# EAGLE schematic motorcontroller_doppeleinheit (EAGLE 7.7.0)
MOTOR_EN von Motorplatine der Doppeleinheit auf max. Spannung prüfen (24V?)
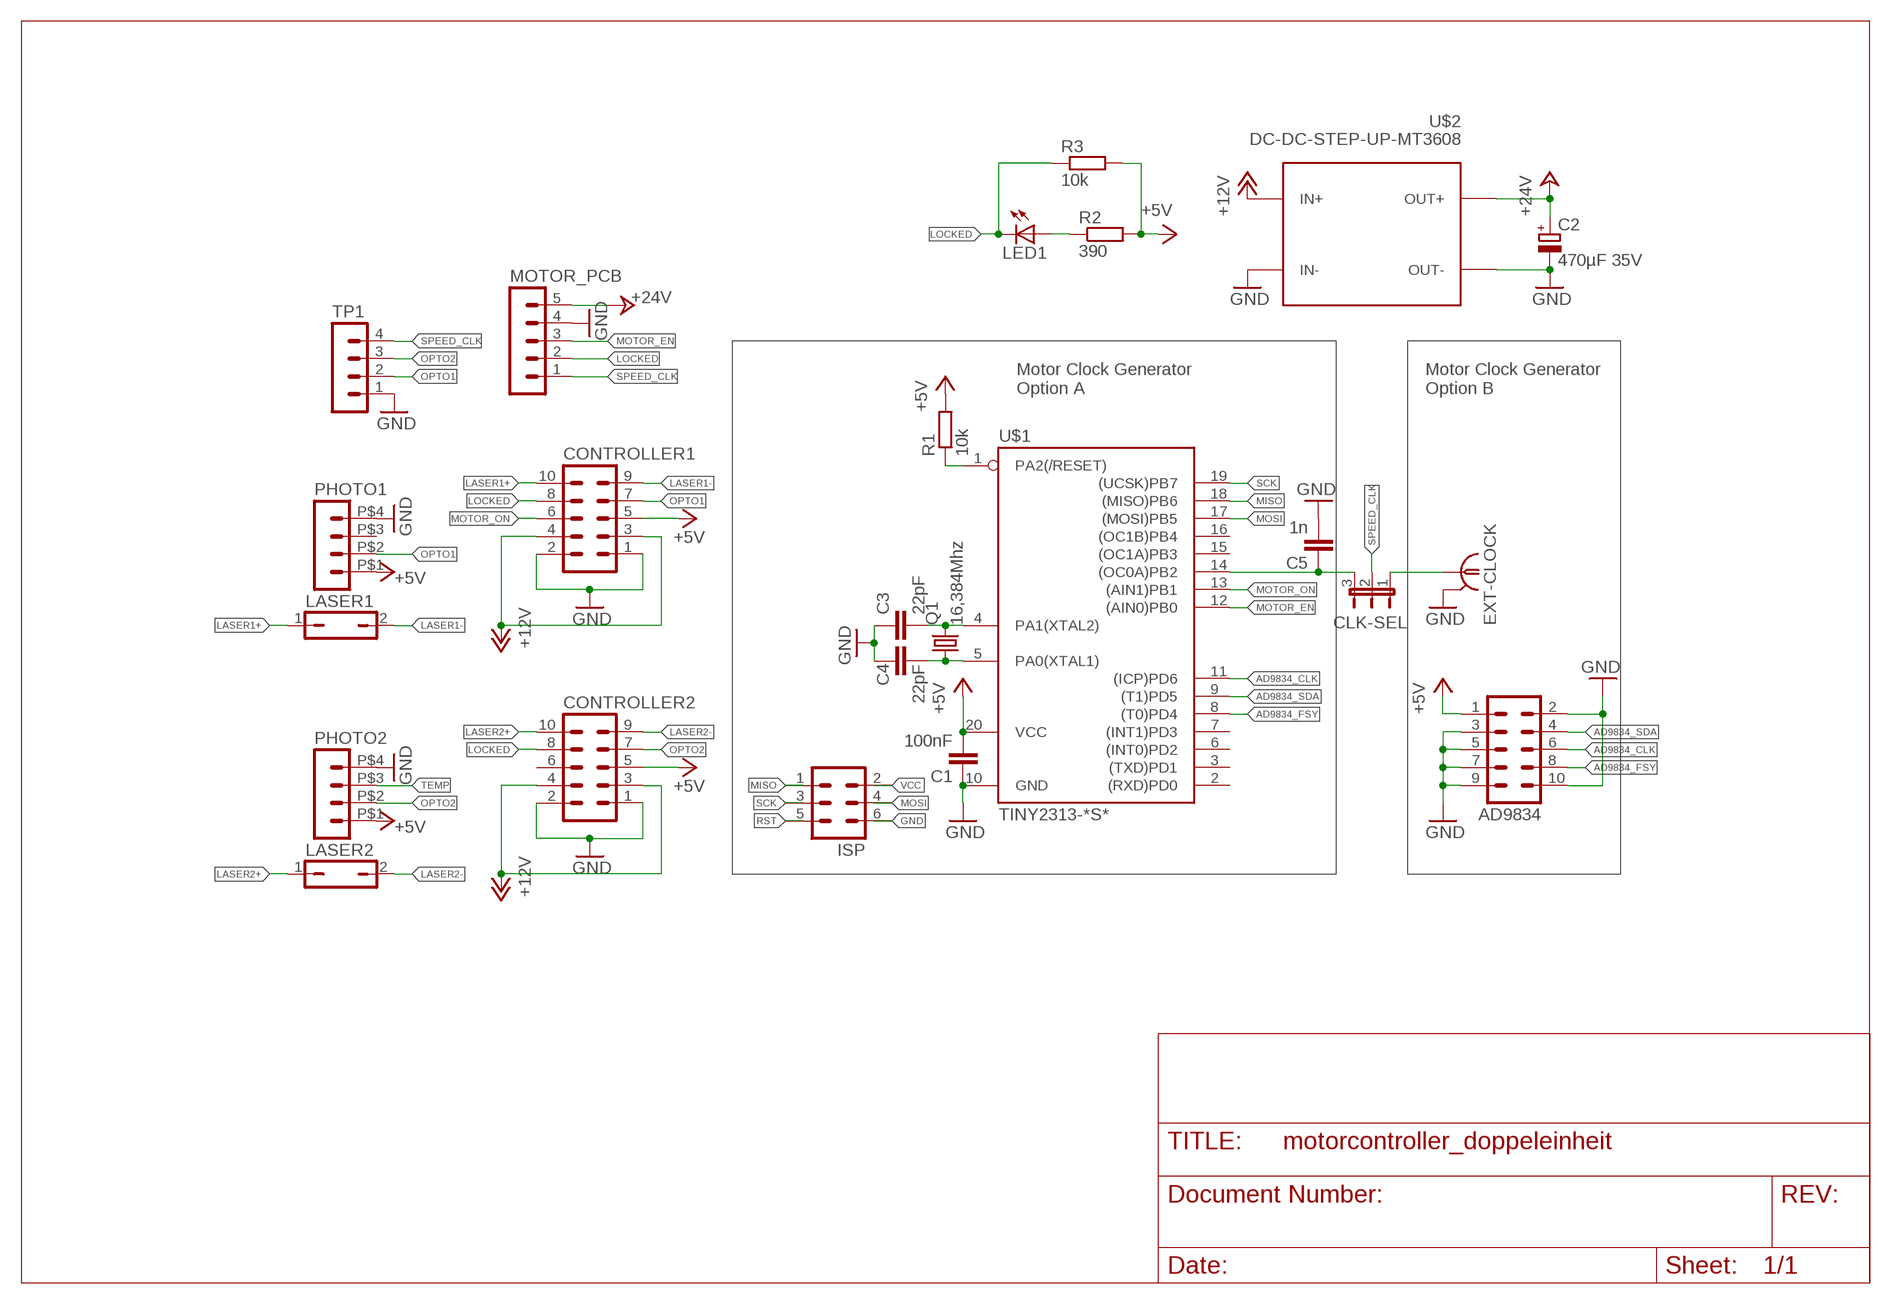
[diagram p0: schematic, sheet 1]

## Parts
AD9834  ML10  [ML10]
C1  100nF  C-EUC1206  [C1206]
C2  470µF 35V  CPOL-EUE5-6  [E5-6]
C3  22pF  C-EUC1206  [C1206]
C4  22pF  C-EUC1206  [C1206]
C5  1n  C-EUC1206  [C1206]
CLK-SEL  JP2E  [JP2]
CONTROLLER1  ML10  [ML10]
CONTROLLER2  ML10  [ML10]
EXT-CLOCK  LTI-SASF54GT  [LTI-SASF54GT]
ISP  ML6L  [ML6L]
LASER1  JP1Q  [JP1]
LASER2  JP1Q  [JP1]
LED1  LED3MM  [LED3MM]
MOTOR_PCB  MA05-1  [MA05-1]
PHOTO1  FLAT_P4  [FLAT_4P]
PHOTO2  FLAT_P4  [FLAT_4P]
Q1  16,384Mhz  CRYSTALHC49UP  [HC49UP]
R1  10k  R-EU_R1206  [R1206]
R2  390  R-EU_R1206  [R1206]
R3  10k  R-EU_R1206  [R1206]
TP1  MA04-1  [MA04-1]
U$1  TINY2313-*S*  [SO20L$]
U$2  DC-DC-STEP-UP-MT3608  [DC-DC-STEP-UP-MT3608]

## Nets
+5V: AD9834.1 C1.2 CONTROLLER1.5 CONTROLLER2.5 PHOTO1.P$1 PHOTO2.P$1 R1.2 R2.2 R3.2 U$1.20(VCC)
+12V: CONTROLLER1.3 CONTROLLER1.4 CONTROLLER2.3 CONTROLLER2.4 U$2.IN+
+24V: C2.+ MOTOR_PCB.5 U$2.OUT+
AD9834_CLK: AD9834.6 U$1.11((ICP)PD6)
AD9834_FSY: AD9834.8 U$1.8((T0)PD4)
AD9834_SDA: AD9834.4 U$1.9((T1)PD5)
GND: AD9834.2 AD9834.3 AD9834.5 AD9834.7 AD9834.9 AD9834.10 C1.1 C2.- C3.1 C4.1 C5.2 CONTROLLER1.1 CONTROLLER1.2 CONTROLLER2.1 CONTROLLER2.2 EXT-CLOCK.2 EXT-CLOCK.3 EXT-CLOCK.4 EXT-CLOCK.5 ISP.6 MOTOR_PCB.4 PHOTO1.P$4 PHOTO2.P$4 TP1.1 U$1.10(GND) U$2.IN- U$2.OUT-
LASER1+: CONTROLLER1.10 LASER1.1
LASER1-: CONTROLLER1.9 LASER1.2
LASER2+: CONTROLLER2.10 LASER2.1
LASER2-: CONTROLLER2.9 LASER2.2
LOCKED: CONTROLLER1.8 CONTROLLER2.8 LED1.K(C) MOTOR_PCB.2 R3.1
MISO: ISP.1 U$1.18((MISO)PB6)
MOSI: ISP.4 U$1.17((MOSI)PB5)
MOTOR_EN: MOTOR_PCB.3 U$1.12((AIN0)PB0)
MOTOR_ON: CONTROLLER1.6 U$1.13((AIN1)PB1)
N$1: C4.2 Q1.1 U$1.5(PA0(XTAL1))
N$2: LED1.A R2.1
N$3: C5.1 CLK-SEL.3 U$1.14((OC0A)PB2)
N$4: CLK-SEL.1 EXT-CLOCK.1
N$5: C3.2 Q1.2 U$1.4(PA1(XTAL2))
OPTO1: CONTROLLER1.7 PHOTO1.P$2 TP1.2
OPTO2: CONTROLLER2.7 PHOTO2.P$2 TP1.3
RST: ISP.5 R1.1 U$1.1(PA2(/RESET))
SCK: ISP.3 U$1.19((UCSK)PB7)
SPEED_CLK: CLK-SEL.2 MOTOR_PCB.1 TP1.4
TEMP: PHOTO2.P$3
VCC: ISP.2
Unconnected: CONTROLLER2.6 PHOTO1.P$3 U$1.2((RXD)PD0) U$1.3((TXD)PD1) U$1.6((INT0)PD2) U$1.7((INT1)PD3) U$1.15((OC1A)PB3) U$1.16((OC1B)PB4)

## Notes on the sheet
- Motor Clock Generator
  Option A
- Motor Clock Generator
  Option B

## Library data of the parts
AD9834 CONTROLLER1 CONTROLLER2 = con-ml:ML10: HARTING; OC_FARNELL: unknown; OC_NEWARK: unknown
C1 C3-C5 = rcl:C-EU: CAPACITOR, European symbol
C2 = rcl:CPOL-EU: POLARIZED CAPACITOR, European symbol
CLK-SEL = jumper:JP2E: JUMPER
EXT-CLOCK = con-coax:LTI-SASF54GT: SMA vertical PCB thrue hole jack Source: Lighthorse Technologies, inc. SASF54GT.pdf; OC_FARNELL: unknown; OC_NEWARK: unknown
ISP = con-harting-ml:ML6: HARTING; OC_FARNELL: unknown; OC_NEWARK: unknown
LASER1 LASER2 = jumper:JP1Q: JUMPER
LED1 = led:LED: LED OSRAM: - CHIPLED LG R971, LG N971, LY N971, LG Q971, LY Q971, LO R971, LY R971 LH N974, LH R974 LS Q976, LO Q976, LY Q976 LO Q996 - Hyper CHIPLED LW Q18S LB Q993, LB Q99A, LB R99A - SideLED LS A670, LO A670, LY A670, LG A670, LP A670 LB A673, LV A673, LT A673, LW A673 LH A674 LY A675 LS A676, LA A676, LO A676, LY A676, LW A676 LS A679, LY A679, LG A679 - Hyper Micro SIDELED® LS Y876, LA Y876, LO Y876, LY Y876 LT Y87S - SmartLED LW L88C, LW L88S LB L89C, LB L89S, LG L890 LS L89K, LO L89K, LY L89K LS L896, LA L896, LO L896, LY L896 - TOPLED LS T670, LO T670, LY T670, LG T670, LP T670 LSG T670, LSP T670, LSY T670, LOP T670, LYG T670 LG T671, LOG T671, LSG T671 LB T673, LV T673, LT T673, LW T673 LH T674 LS T676, LA T676, LO T676, LY T676, LB T676, LH T676, LSB T676, LW T676 LB T67C, LV T67C, LT T67C, LS T67K, LO T67K, LY T67K, LW E67C LS E67B, LA E67B, LO E67B, LY E67B, LB E67C, LV E67C, LT E67C LW T67C LS T679, LY T679, LG T679 LS T770, LO T770, LY T770, LG T770, LP T770 LB T773, LV T773, LT T773, LW T773 LH T774 LS E675, LA E675, LY E675, LS T675 LS T776, LA T776, LO T776, LY T776, LB T776 LHGB T686 LT T68C, LB T68C - Hyper Mini TOPLED® LB M676 - Mini TOPLED Santana® LG M470 LS M47K, LO M47K, LY M47K Source: http://www.osram.convergy.de LUXEON: - LUMILED® LXK2-PW12-R00, LXK2-PW12-S00, LXK2-PW14-U00, LXK2-PW14-V00 LXK2-PM12-R00, LXK2-PM12-S00, LXK2-PM14-U00 LXK2-PE12-Q00, LXK2-PE12-R00, LXK2-PE12-S00, LXK2-PE14-T00, LXK2-PE14-U00 LXK2-PB12-K00, LXK2-PB12-L00, LXK2-PB12-M00, LXK2-PB14-N00, LXK2-PB14-P00, LXK2-PB14-Q00 LXK2-PR12-L00, LXK2-PR12-M00, LXK2-PR14-Q00, LXK2-PR14-R00 LXK2-PD12-Q00, LXK2-PD12-R00, LXK2-PD12-S00 LXK2-PH12-R00, LXK2-PH12-S00 LXK2-PL12-P00, LXK2-PL12-Q00, LXK2-PL12-R00 Source: www.luxeon.com KINGBRIGHT: KA-3528ASYC Source: www.kingbright.com
MOTOR_PCB = con-lstb:MA05-1: PIN HEADER; OC_FARNELL: unknown; OC_NEWARK: unknown
PHOTO1 PHOTO2 = _custom_con:FLAT_P4
Q1 = crystal:CRYSTAL: CRYSTAL; OC_FARNELL: unknown; OC_NEWARK: unknown
R1-R3 = rcl:R-EU_: RESISTOR, European symbol
TP1 = con-lstb:MA04-1: PIN HEADER; OC_FARNELL: unknown; OC_NEWARK: unknown
U$1 = avr-7:TINY2313*: Atmel Tiny2313 2K Flash, 128 bytes EEPROM, 128 bytes RAM
U$2 = diy-modules:DC-DC-STEP-UP-MT3608: DC/DC Step-Up Regulator based on MT3608 chip MT3608 datasheet available here: https://www.olimex.com/Products/Breadboarding/BB-PWR-3608/resources/MT3608.pdf Click here to find device on ebay.com <http://www.ebay.com/sch/mt3608+module>